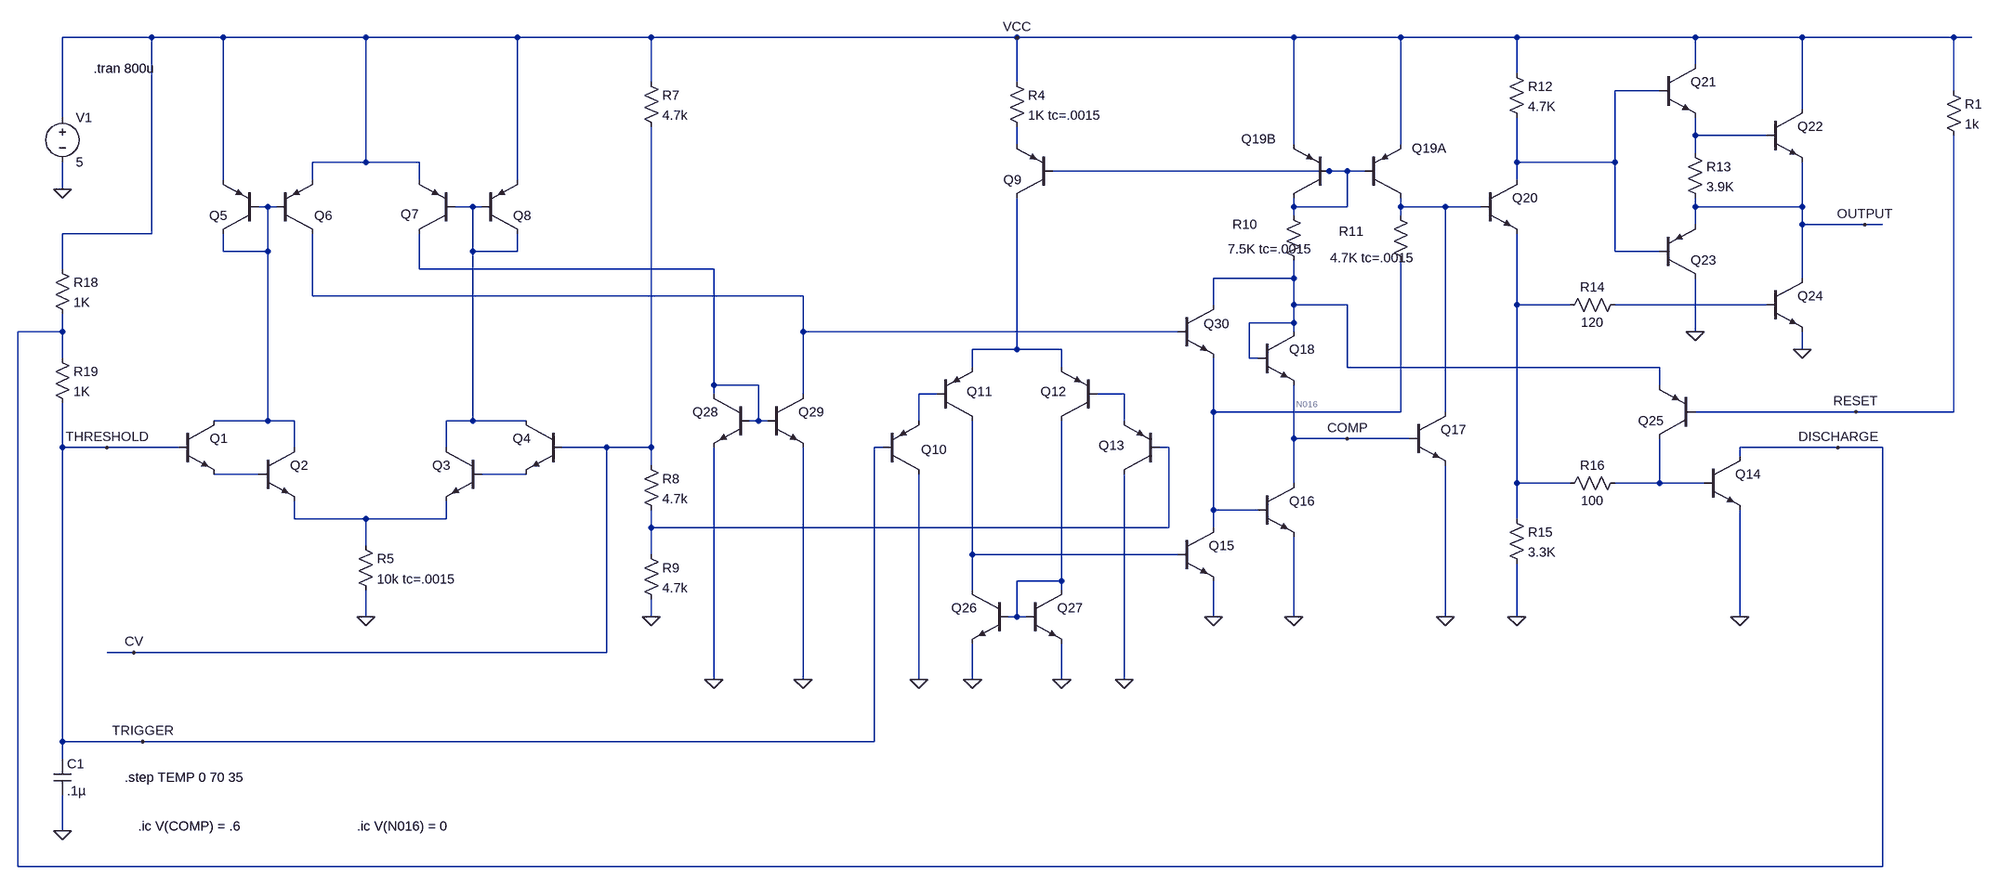
[diagram p0: schematic lm555.asc]
lm555.asc, the LTspice schematic file:
Version 4
SHEET 1 2980 1140
WIRE -368 -352 -528 -352
WIRE -240 -352 -368 -352
WIRE 16 -352 -240 -352
WIRE 288 -352 16 -352
WIRE 528 -352 288 -352
WIRE 1184 -352 528 -352
WIRE 1680 -352 1184 -352
WIRE 1872 -352 1680 -352
WIRE 2080 -352 1872 -352
WIRE 2400 -352 2080 -352
WIRE 2592 -352 2400 -352
WIRE 2864 -352 2592 -352
WIRE 2896 -352 2864 -352
WIRE 2400 -304 2400 -352
WIRE 2080 -288 2080 -352
WIRE 528 -272 528 -352
WIRE 1184 -272 1184 -352
WIRE 2336 -256 2256 -256
WIRE 2864 -256 2864 -352
WIRE 2592 -224 2592 -352
WIRE -528 -208 -528 -352
WIRE 2400 -176 2400 -208
WIRE 2528 -176 2400 -176
WIRE 1184 -160 1184 -192
WIRE 1680 -160 1680 -352
WIRE 1872 -160 1872 -352
WIRE 2400 -144 2400 -176
WIRE 16 -128 16 -352
WIRE 16 -128 -80 -128
WIRE 112 -128 16 -128
WIRE 2080 -128 2080 -208
WIRE 2256 -128 2256 -256
WIRE 2256 -128 2080 -128
WIRE 1744 -112 1248 -112
WIRE 1776 -112 1744 -112
WIRE 1808 -112 1776 -112
WIRE -240 -96 -240 -352
WIRE -80 -96 -80 -128
WIRE 112 -96 112 -128
WIRE 288 -96 288 -352
WIRE 2080 -96 2080 -128
WIRE -528 -80 -528 -128
WIRE -160 -48 -176 -48
WIRE -144 -48 -160 -48
WIRE 208 -48 176 -48
WIRE 224 -48 208 -48
WIRE 1680 -48 1680 -64
WIRE 1776 -48 1776 -112
WIRE 1776 -48 1680 -48
WIRE 1872 -48 1872 -64
WIRE 1952 -48 1872 -48
WIRE 2016 -48 1952 -48
WIRE 2400 -48 2400 -64
WIRE 2592 -48 2592 -128
WIRE 2592 -48 2400 -48
WIRE 1680 -32 1680 -48
WIRE 1872 -32 1872 -48
WIRE 2400 -16 2400 -48
WIRE 2592 -16 2592 -48
WIRE 2704 -16 2592 -16
WIRE 2736 -16 2704 -16
WIRE -368 0 -368 -352
WIRE -368 0 -528 0
WIRE -240 32 -240 0
WIRE -160 32 -160 -48
WIRE -160 32 -240 32
WIRE 208 32 208 -48
WIRE 288 32 288 0
WIRE 288 32 208 32
WIRE 2256 32 2256 -128
WIRE 2336 32 2256 32
WIRE -528 64 -528 0
WIRE 112 64 112 0
WIRE 640 64 112 64
WIRE 1680 80 1680 48
WIRE 1680 80 1536 80
WIRE 2592 80 2592 -16
WIRE -80 112 -80 0
WIRE 800 112 -80 112
WIRE 1536 128 1536 80
WIRE 1680 128 1680 80
WIRE 1776 128 1680 128
WIRE 2080 128 2080 0
WIRE 2176 128 2080 128
WIRE 2528 128 2256 128
WIRE 1680 160 1680 128
WIRE 1680 160 1600 160
WIRE -528 176 -528 144
WIRE -528 176 -608 176
WIRE 800 176 800 112
WIRE 1472 176 800 176
WIRE 1680 176 1680 160
WIRE 2400 176 2400 80
WIRE 1184 208 1184 -64
WIRE 1184 208 1104 208
WIRE 1264 208 1184 208
WIRE 2592 208 2592 176
WIRE -528 224 -528 176
WIRE 1600 224 1600 160
WIRE 1616 224 1600 224
WIRE 1104 240 1104 208
WIRE 1264 240 1264 208
WIRE 1776 240 1776 128
WIRE 2336 240 1776 240
WIRE 640 272 640 64
WIRE 720 272 640 272
WIRE 2336 272 2336 240
WIRE 640 288 640 272
WIRE 800 288 800 176
WIRE 1040 288 1008 288
WIRE 1376 288 1328 288
WIRE 1536 320 1536 224
WIRE 1872 320 1872 48
WIRE 1872 320 1536 320
WIRE 1952 320 1952 -48
WIRE 2688 320 2400 320
WIRE 2864 320 2864 -176
WIRE 2864 320 2688 320
WIRE -160 336 -160 32
WIRE -160 336 -256 336
WIRE -112 336 -160 336
WIRE 208 336 208 32
WIRE 208 336 160 336
WIRE 304 336 208 336
WIRE 720 336 720 272
WIRE 720 336 704 336
WIRE 736 336 720 336
WIRE 1008 336 1008 288
WIRE 1376 336 1376 288
WIRE 1680 368 1680 272
WIRE 1776 368 1680 368
WIRE 1888 368 1776 368
WIRE -528 384 -528 304
WIRE -448 384 -528 384
WIRE -320 384 -448 384
WIRE -112 384 -112 336
WIRE 160 384 160 336
WIRE 448 384 368 384
WIRE 528 384 528 -192
WIRE 528 384 448 384
WIRE 944 384 928 384
WIRE 1456 384 1440 384
WIRE 2656 384 2480 384
WIRE 2736 384 2656 384
WIRE 2480 400 2480 384
WIRE 528 416 528 384
WIRE -176 432 -256 432
WIRE 304 432 224 432
WIRE 1680 448 1680 368
WIRE 2080 448 2080 128
WIRE 2176 448 2080 448
WIRE 2336 448 2336 368
WIRE 2336 448 2256 448
WIRE 2416 448 2336 448
WIRE 1536 496 1536 320
WIRE 1616 496 1536 496
WIRE -112 512 -112 480
WIRE 16 512 -112 512
WIRE 160 512 160 480
WIRE 160 512 16 512
WIRE 2080 512 2080 448
WIRE 528 528 528 496
WIRE 1456 528 1456 384
WIRE 1456 528 528 528
WIRE 1536 528 1536 496
WIRE 16 560 16 512
WIRE 528 576 528 528
WIRE 1104 576 1104 336
WIRE 1472 576 1104 576
WIRE 1264 624 1264 336
WIRE 1264 624 1184 624
WIRE 1104 640 1104 576
WIRE 1264 640 1264 624
WIRE 16 688 16 640
WIRE 528 688 528 656
WIRE 1184 688 1184 624
WIRE 1184 688 1168 688
WIRE 1200 688 1184 688
WIRE 1536 688 1536 624
WIRE 1680 688 1680 544
WIRE 1952 688 1952 416
WIRE 2080 688 2080 592
WIRE 2480 688 2480 496
WIRE -400 752 -448 752
WIRE 448 752 448 384
WIRE 448 752 -400 752
WIRE 640 800 640 384
WIRE 800 800 800 384
WIRE 1008 800 1008 432
WIRE 1104 800 1104 736
WIRE 1264 800 1264 736
WIRE 1376 800 1376 432
WIRE -528 912 -528 384
WIRE -384 912 -528 912
WIRE 928 912 928 384
WIRE 928 912 -384 912
WIRE -528 944 -528 912
WIRE -528 1072 -528 1008
WIRE -608 1136 -608 176
WIRE 2736 1136 2736 384
WIRE 2736 1136 -608 1136
FLAG 16 688 0
FLAG -528 -80 0
FLAG 528 688 0
FLAG 1008 800 0
FLAG 1376 800 0
FLAG 1104 800 0
FLAG 1536 688 0
FLAG 1680 688 0
FLAG 1952 688 0
FLAG 2080 688 0
FLAG 2592 208 0
FLAG 2480 688 0
FLAG 1184 -352 VCC
FLAG 2704 -16 OUTPUT
FLAG 2688 320 RESET
FLAG 2656 384 DISCHARGE
FLAG -384 912 TRIGGER
FLAG -400 752 CV
FLAG -448 384 THRESHOLD
FLAG 1264 800 0
FLAG 640 800 0
FLAG 800 800 0
FLAG 2400 176 0
FLAG -528 1072 0
FLAG 1776 368 COMP
SYMBOL npn -320 336 R0
WINDOW 3 56 68 Invisible 2
SYMATTR Value 2N3904
SYMATTR InstName Q1
SYMBOL npn -176 384 R0
WINDOW 3 56 68 Invisible 2
SYMATTR Value 2N3904
SYMATTR InstName Q2
SYMBOL npn 224 384 M0
WINDOW 3 56 68 Invisible 2
SYMATTR Value 2N3904
SYMATTR InstName Q3
SYMBOL npn 368 336 M0
WINDOW 3 56 68 Invisible 2
SYMATTR Value 2N3904
SYMATTR InstName Q4
SYMBOL pnp -176 0 R180
WINDOW 3 84 68 Invisible 2
SYMATTR Value 2N3906
SYMATTR InstName Q5
SYMBOL pnp -144 0 M180
WINDOW 0 68 32 Left 2
WINDOW 3 66 68 Invisible 2
SYMATTR InstName Q6
SYMATTR Value 2N3906
SYMBOL pnp 176 0 R180
WINDOW 0 65 35 Left 2
WINDOW 3 67 68 Invisible 2
SYMATTR InstName Q7
SYMATTR Value 2N3906
SYMBOL pnp 224 0 M180
WINDOW 3 84 68 Invisible 2
SYMATTR Value 2N3906
SYMATTR InstName Q8
SYMBOL res 0 544 R0
SYMATTR InstName R5
SYMATTR Value 10k tc=.0015
SYMBOL res 512 400 R0
SYMATTR InstName R8
SYMATTR Value 4.7k
SYMBOL res 512 560 R0
SYMATTR InstName R9
SYMATTR Value 4.7k
SYMBOL res 512 -288 R0
SYMATTR InstName R7
SYMATTR Value 4.7k
SYMBOL voltage -528 -224 R0
WINDOW 123 0 0 Left 2
WINDOW 39 0 0 Left 2
SYMATTR InstName V1
SYMATTR Value 5
SYMBOL pnp 1248 -64 R180
WINDOW 3 84 68 Invisible 2
SYMATTR Value 2N3906
SYMATTR InstName Q9
SYMBOL pnp 944 432 M180
WINDOW 0 68 44 Left 2
WINDOW 3 84 68 Invisible 2
SYMATTR InstName Q10
SYMATTR Value 2N3906
SYMBOL pnp 1040 336 M180
WINDOW 0 54 52 Left 2
WINDOW 3 68 68 Invisible 2
SYMATTR InstName Q11
SYMATTR Value 2N3906
SYMBOL pnp 1328 336 R180
WINDOW 0 56 52 Left 2
WINDOW 3 70 68 Invisible 2
SYMATTR InstName Q12
SYMATTR Value 2N3906
SYMBOL pnp 1440 432 R180
WINDOW 0 64 52 Left 2
WINDOW 3 84 68 Invisible 2
SYMATTR InstName Q13
SYMATTR Value 2N3906
SYMBOL res 1168 -288 R0
SYMATTR InstName R4
SYMATTR Value 1K tc=.0015
SYMBOL npn 1472 528 R0
WINDOW 3 56 68 Invisible 2
SYMATTR Value 2N3904
SYMATTR InstName Q15
SYMBOL npn 1616 448 R0
WINDOW 3 56 68 Invisible 2
SYMATTR Value 2N3904
SYMATTR InstName Q16
SYMBOL npn 1888 320 R0
WINDOW 3 56 68 Invisible 2
SYMATTR Value 2N3904
SYMATTR InstName Q17
SYMBOL npn 1616 176 R0
WINDOW 3 56 68 Invisible 2
SYMATTR Value 2N3904
SYMATTR InstName Q18
SYMBOL pnp 1744 -64 R180
WINDOW 0 96 106 Left 2
WINDOW 3 84 68 Invisible 2
SYMATTR InstName Q19B
SYMATTR Value 2N3906
SYMBOL pnp 1808 -64 M180
WINDOW 0 84 89 Left 2
WINDOW 3 84 68 Invisible 2
SYMATTR InstName Q19A
SYMATTR Value 2N3906
SYMBOL res 1664 -48 R0
WINDOW 0 -94 32 Left 2
WINDOW 3 -102 76 Left 2
SYMATTR InstName R10
SYMATTR Value 7.5K tc=.0015
SYMBOL res 1856 -48 R0
WINDOW 0 -95 44 Left 2
WINDOW 3 -111 92 Left 2
SYMATTR InstName R11
SYMATTR Value 4.7K tc=.0015
SYMBOL npn 2016 -96 R0
WINDOW 3 56 68 Invisible 2
SYMATTR Value 2N3904
SYMATTR InstName Q20
SYMBOL res 2064 -304 R0
SYMATTR InstName R12
SYMATTR Value 4.7K
SYMBOL res 2064 496 R0
SYMATTR InstName R15
SYMATTR Value 3.3K
SYMBOL npn 2336 -304 R0
WINDOW 3 56 68 Invisible 2
SYMATTR Value 2N3904
SYMATTR InstName Q21
SYMBOL pnp 2336 80 M180
WINDOW 3 84 68 Invisible 2
SYMATTR Value 2N3906
SYMATTR InstName Q23
SYMBOL npn 2528 -224 R0
WINDOW 3 56 68 Invisible 2
SYMATTR Value 2N3904
SYMATTR InstName Q22
SYMBOL res 2384 -160 R0
SYMATTR InstName R13
SYMATTR Value 3.9K
SYMBOL npn 2528 80 R0
WINDOW 3 56 68 Invisible 2
SYMATTR Value 2N3904
SYMATTR InstName Q24
SYMBOL res 2272 112 R90
WINDOW 0 0 56 VBottom 2
WINDOW 3 32 56 VTop 2
SYMATTR InstName R14
SYMATTR Value 120
SYMBOL npn 2416 400 R0
WINDOW 3 56 68 Invisible 2
SYMATTR Value 2N3904
SYMATTR InstName Q14
SYMBOL res 2272 432 R90
WINDOW 0 0 56 VBottom 2
WINDOW 3 32 56 VTop 2
SYMATTR InstName R16
SYMATTR Value 100
SYMBOL pnp 2400 368 R180
WINDOW 3 84 68 Invisible 2
SYMATTR Value 2N3906
SYMATTR InstName Q25
SYMBOL npn 1200 640 R0
WINDOW 3 56 68 Invisible 2
SYMATTR Value 2N3904
SYMATTR InstName Q27
SYMBOL npn 1168 640 M0
WINDOW 3 56 68 Invisible 2
SYMATTR Value 2N3904
SYMATTR InstName Q26
SYMBOL npn 704 288 M0
WINDOW 3 56 68 Invisible 2
SYMATTR Value 2N3904
SYMATTR InstName Q28
SYMBOL npn 736 288 R0
WINDOW 3 56 68 Invisible 2
SYMATTR Value 2N3904
SYMATTR InstName Q29
SYMBOL npn 1472 128 R0
WINDOW 0 47 34 Left 2
WINDOW 3 39 63 Invisible 2
SYMATTR InstName Q30
SYMATTR Value 2N3904
SYMBOL res 2848 -272 R0
SYMATTR InstName R1
SYMATTR Value 1k
SYMBOL cap -544 944 R0
SYMATTR InstName C1
SYMATTR Value .1µ
SYMATTR SpiceLine2 IC=2.5
SYMBOL res -544 208 R0
SYMATTR InstName R19
SYMATTR Value 1K
SYMBOL res -544 48 R0
SYMATTR InstName R18
SYMATTR Value 1K
TEXT -472 -296 Left 2 !.tran 800u
TEXT -416 976 Left 2 !.step TEMP 0 70 35
TEXT -392 1064 Left 2 !.ic V(COMP) = .6
TEXT 0 1064 Left 2 !.ic V(N016) = 0

The netlist it stands for:
* lm555.asc
Q1 N005 THRESHOLD N018 0 2N3904
Q2 N005 N018 N021 0 2N3904
Q3 N006 N019 N021 0 2N3904
Q4 N006 CV N019 0 2N3904
Q5 N005 N005 VCC 0 2N3906
Q6 N010 N005 VCC 0 2N3906
Q7 N008 N006 VCC 0 2N3906
Q8 N006 N006 VCC 0 2N3906
R5 N021 0 10k tc=.0015
R8 CV N017 4.7k
R9 N017 0 4.7k
R7 VCC CV 4.7k
V1 VCC 0 5
Q9 N013 N004 N003 0 2N3906
Q10 0 THRESHOLD N014 0 2N3906
Q11 N022 N014 N013 0 2N3906
Q12 N023 N015 N013 0 2N3906
Q13 0 N017 N015 0 2N3906
R4 VCC N003 1K tc=.0015
Q15 N016 N022 0 0 2N3904
Q16 COMP N016 0 0 2N3904
Q17 N007 COMP 0 0 2N3904
Q18 N009 N009 COMP 0 2N3904
Q19B N004 N004 VCC 0 2N3906
Q19A N007 N004 VCC 0 2N3906
R10 N004 N009 7.5K tc=.0015
R11 N007 N016 4.7K tc=.0015
Q20 N001 N007 N011 0 2N3904
R12 VCC N001 4.7K
R15 N011 0 3.3K
Q21 VCC N001 N002 0 2N3904
Q23 0 N001 OUTPUT 0 2N3906
Q22 VCC N002 OUTPUT 0 2N3904
R13 N002 OUTPUT 3.9K
Q24 OUTPUT N012 0 0 2N3904
R14 N012 N011 120
Q14 DISCHARGE N020 0 0 2N3904
R16 N020 N011 100
Q25 N020 RESET N009 0 2N3906
Q27 N023 N023 0 0 2N3904
Q26 N022 N023 0 0 2N3904
Q28 N008 N008 0 0 2N3904
Q29 N010 N008 0 0 2N3904
Q30 N009 N010 N016 0 2N3904
R1 VCC RESET 1k
C1 THRESHOLD 0 .1µ IC=2.5
R19 DISCHARGE THRESHOLD 1K
R18 VCC DISCHARGE 1K
.model NPN NPN
.model PNP PNP
.lib standard.bjt
.tran 800u
.step TEMP 0 70 35
.ic V(COMP) = .6
.ic V(N016) = 0
.backanno
.end